# EasyEDA schematic SCH_esp32_2022-05-23.json
TITLE: Sheet_1; REV: 1.0; Date: 2022-04-08; Sheet: 1/1; Drawn By: lian_aarts; Company: Your Company
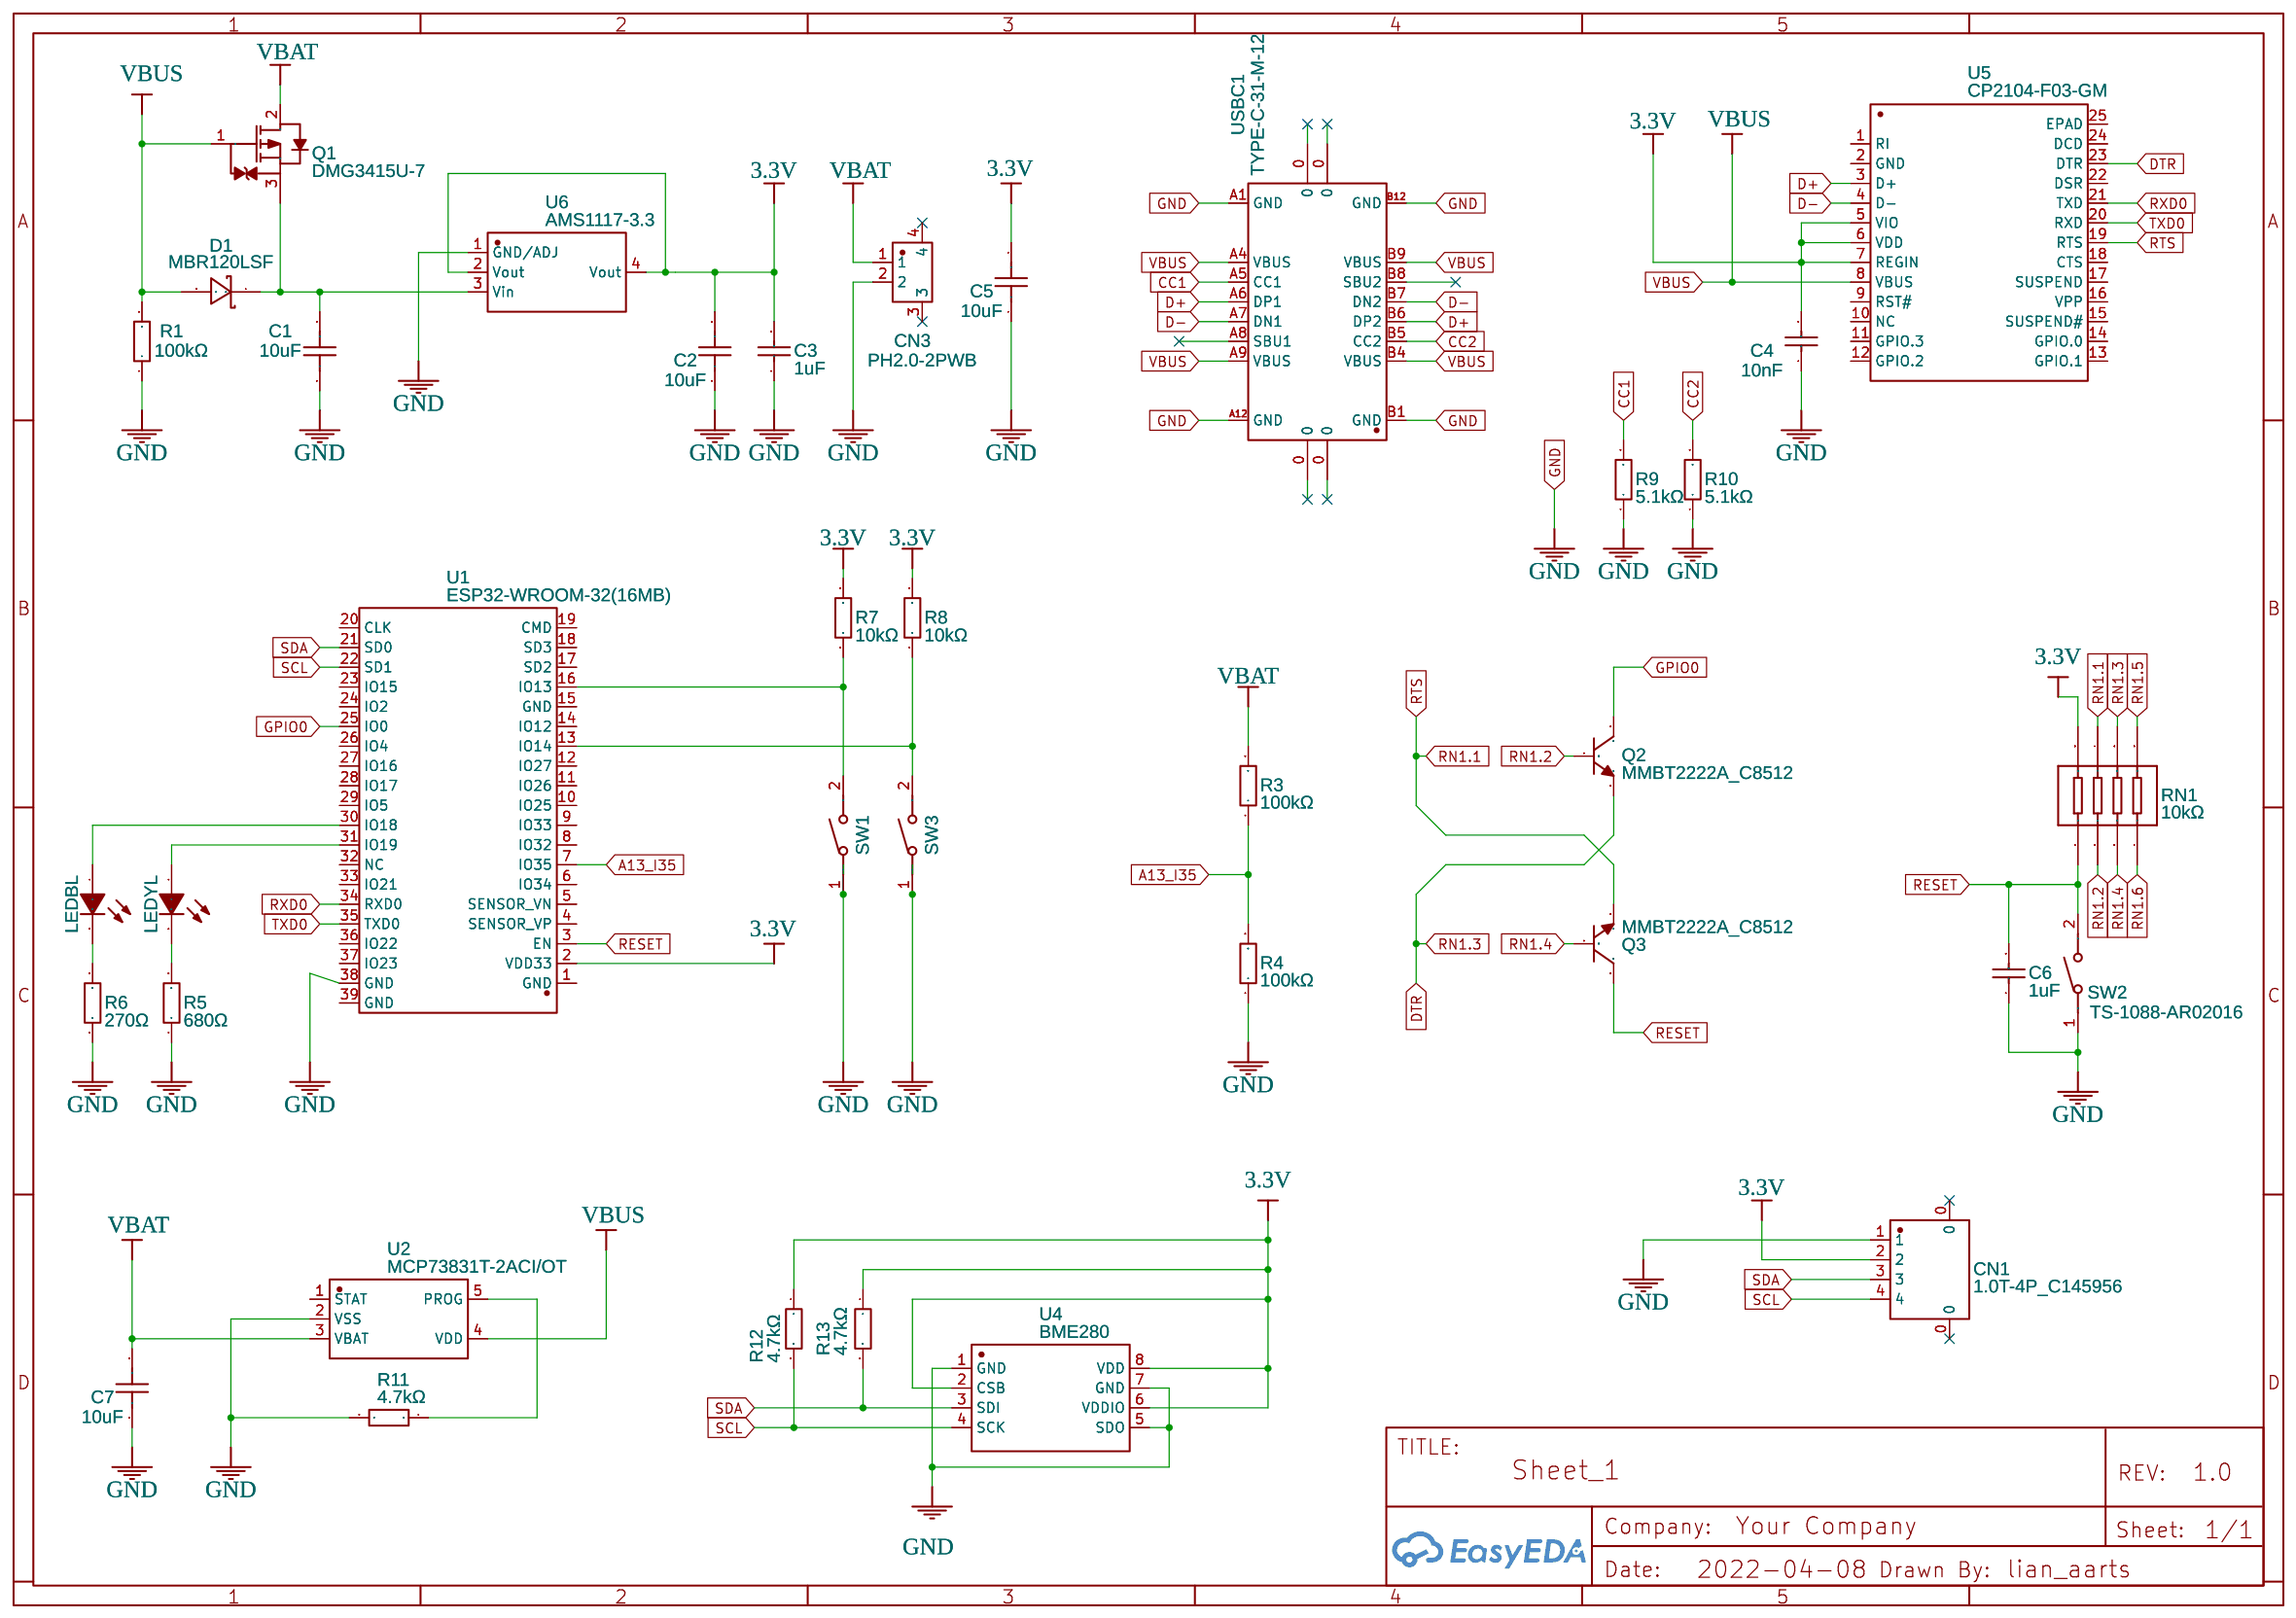
[diagram p0: schematic sheet]

## Parts
C1  10uF  [C0805]
C2  10uF  [C0805]
C3  1uF  [C0603]
C4  10nF  [C0805]
C5  10uF  [C0805]
C6  1uF  [C0603]
C7  10uF  [C0805]
CN1  1.0T-4P_C145956  [CONN-SMD_1.0T-4P]
CN3  PH2.0-2PWB  [CONN-SMD_2P-P2.00_PH2.0-SPWB]
D1  MBR120LSF  [SOD-123_L2.8-W1.8-LS3.7-RD]
LEDBL  19-217/BHC-ZL1M2RY/3T  [LED0603-R-RD_BLUE]
LEDYL  19-213/Y2C-CQ2R2L/3T(CY)  [LED0603-R-RD]
Q1  DMG3415U-7  [SOT-23-3_L2.9-W1.6-P1.90-LS2.8-BR-CW]
Q2  MMBT2222A_C8512  [SOT-23-3_L2.9-W1.3-P1.90-LS2.4-BR]
Q3  MMBT2222A_C8512  [SOT-23-3_L2.9-W1.3-P1.90-LS2.4-BR]
R1  100kΩ  [R0603]
R3  100kΩ  [R0603]
R4  100kΩ  [R0603]
R5  680Ω  [R0603]
R6  270Ω  [R0603]
R7  10kΩ  [R0603]
R8  10kΩ  [R0603]
R9  5.1kΩ  [R0603]
R10  5.1kΩ  [R0603]
R11  4.7kΩ  [R0603]
R12  4.7kΩ  [R0603]
R13  4.7kΩ  [R0603]
RN1  10kΩ  [RES-ARRAY-SMD_0603-8P-L3.2-W1.6-BL]
SW1  TS-1088-AR02016  [SW-SMD_L4.0-W2.9-LS5.0]
SW2  TS-1088-AR02016  [SW-SMD_L4.0-W2.9-LS5.0]
SW3  TS-1088-AR02016  [SW-SMD_L4.0-W2.9-LS5.0]
U1  ESP32-WROOM-32(16MB)  [WIFIM-SMD_39P-L25.5-W18.0-P1.27]
U2  MCP73831T-2ACI/OT  [SOT-23-5_L3.0-W1.7-P0.95-LS2.8-BR]
U4  BME280  [LGA-8_BME280_BL]
U5  CP2104-F03-GM  [QFN-24_L4.0-W4.0-P0.50-BL-EP2.7]
U6  AMS1117-3.3  [SOT-223-3_L6.5-W3.4-P2.30-LS7.0-BR]
USBC1  TYPE-C-31-M-12  [USB-C_SMD-TYPE-C-31-M-12]

## Library data of the parts
C1 C2 C5 C7 = GRM21BR61H106KE43L: Supplier: LCSC; Supplier Part: C440198; Manufacturer: Murata Electronics; Contributor: LCSC; JLCPCB Part Class: Basic Part
C3 C6 = CL10A105KB8NNNC: Supplier: LCSC; Manufacturer: SAMSUNG; Supplier Part: C15849; JLCPCB Part Class: Basic Part
C4 = CL21B103KBANNNC: Supplier: LCSC; Manufacturer: SAMSUNG; Supplier Part: C1710; JLCPCB Part Class: Basic Part
CN1 = 1.0T-4P_C145956: Supplier: LCSC; Supplier Part: C145956; Manufacturer: Boom Precision Elec; Contributor: 立创EDA官方封装库; JLCPCB Part Class: Extended Part
CN3 = PH2.0-2PWB: Supplier: LCSC; Manufacturer: BOOMELE; Manufacturer Part: PH2.0-2PWB Horizontal; Supplier Part: C47647; JLCPCB Part Class: Extended Part
D1 = MBR120LSF: Supplier: LCSC; Manufacturer: SK; Contributor: LCSC; Supplier Part: C130880; JLCPCB Part Class: Extended Part
LEDBL = 19-217/BHC-ZL1M2RY/3T: Supplier: LCSC; Manufacturer: EVERLIGHT; Supplier Part: C72041; JLCPCB Part Class: Basic Part
LEDYL = 19-213/Y2C-CQ2R2L/3T(CY): Supplier: LCSC; Manufacturer: EVERLIGHT; Supplier Part: C72038; JLCPCB Part Class: Basic Part
Q1 = DMG3415U-7: Supplier: LCSC; Supplier Part: C96616; Manufacturer: Diodes Incorporated; Contributor: LCSC; JLCPCB Part Class: Extended Part
Q2 Q3 = MMBT2222A_C8512: Supplier: LCSC; Manufacturer: CJ; Manufacturer Part: MMBT2222A; Supplier Part: C8512; JLCPCB Part Class: Basic Part
R1 R3 R4 = 0603WAF1003T5E: Supplier: LCSC; Manufacturer: UniOhm; Supplier Part: C25803; Resistance (Ohms): 100K; JLCPCB Part Class: Basic Part
R5 = 0603WAF6800T5E: Supplier: LCSC; Manufacturer: UniOhm; Supplier Part: C23228; Resistance (Ohms): 680; JLCPCB Part Class: Basic Part
R6 = 0603WAF2700T5E: Supplier: LCSC; Manufacturer: UniOhm; Supplier Part: C22966; Resistance (Ohms): 270; JLCPCB Part Class: Basic Part
R7 R8 = 0603WAF1002T5E: Supplier: LCSC; Manufacturer: UniOhm; Supplier Part: C25804; Resistance (Ohms): 10K; JLCPCB Part Class: Basic Part
R9 R10 = 0603WAF5101T5E: Supplier: LCSC; Manufacturer: UniOhm; Supplier Part: C23186; Resistance (Ohms): 5.1K; JLCPCB Part Class: Basic Part
R11-R13 = 0603WAF4701T5E: Supplier: LCSC; Manufacturer: UniOhm; Supplier Part: C23162; Resistance (Ohms): 4.7K; JLCPCB Part Class: Basic Part
RN1 = RTA03-4D103JTP: Supplier: LCSC; Manufacturer: RALEC; Supplier Part: C102646; Resistance (Ohms): 10K; JLCPCB Part Class: Extended Part
SW1-SW3 = TS-1088-AR02016: Supplier: LCSC; Supplier Part: C720477; Manufacturer: XUNPU; Contributor: LCSC; JLCPCB Part Class: Extended Part
U1 = ESP32-WROOM-32(16MB): Supplier: LCSC; Supplier Part: C529581; Manufacturer: Espressif Systems; Contributor: LCSC; JLCPCB Part Class: Extended Part
U2 = MCP73831T-2ACI/OT: Supplier: LCSC; Supplier Part: C424093; Manufacturer: Microchip Tech; Contributor: LCSC; JLCPCB Part Class: Extended Part
U4 = BME280: Supplier: LCSC; Manufacturer: Bosch; Contributor: LCSC; Supplier Part: C92489; JLCPCB Part Class: Extended Part
U5 = CP2104-F03-GM: Supplier: LCSC; Manufacturer: SILICON LABS; Supplier Part: C47742; JLCPCB Part Class: Extended Part
U6 = AMS1117-3.3: sourceId: dwIGgezVh; Supplier: LCSC; Manufacturer: AMS; Supplier Part: C6186; JLCPCB Part Class: Basic Part
USBC1 = TYPE-C-31-M-12: Supplier: LCSC; Supplier Part: C165948; Manufacturer: Rectangular Connectors - Contacts; Contributor: LCSC; JLCPCB Part Class: Extended Part

## Nets
3.3V: C2.2 C3.2 C4.2 C5.2 CN1.2 R7.2 R8.2 R12.1 R13.1 RN1.8 U1.2(VDD33) U4.2(CSB) U4.6(VDDIO) U4.8(VDD) U5.5(VIO) U5.6(VDD) U5.7(REGIN) U6.2(Vout) U6.4(Vout)
GND: C1.1 C2.1 C3.1 C4.1 C5.1 C6.1 C7.1 CN1.1 CN3.2 R1.1 R4.1 R5.1 R6.1 R9.1 R10.1 R11.2 SW1.1 SW2.1 SW3.1 U1.38(GND) U2.2(VSS) U4.1(GND) U4.5(SDO) U4.7(GND) U6.1(GND/ADJ) USBC1.A1(GND) USBC1.A12(GND) USBC1.B1(GND) USBC1.B12(GND)
VBAT: C7.2 CN3.1 Q1.2(D) R3.2 U2.3(VBAT)
VBUS: D1.2(A) Q1.1(G) R1.2 U2.4(VDD) U5.8(VBUS) USBC1.A4(VBUS) USBC1.A9(VBUS) USBC1.B4(VBUS) USBC1.B9(VBUS)
A13_I35: R3.1 R4.2 U1.7(IO35)
CC1: R9.2 USBC1.A5(CC1)
CC2: R10.2 USBC1.B5(CC2)
D+: U5.3(D+) USBC1.A6(DP1) USBC1.B6(DP2)
D-: U5.4(D-) USBC1.A7(DN1) USBC1.B7(DN2)
DTR: Q2.2(E) RN1.6 U5.23(DTR)
GPIO0: Q2.3(C) U1.25(IO0)
RESET: C6.2 Q3.3(C) RN1.1 SW2.2 U1.3(EN)
RN1.1: Q3.2(E) RN1.7 U5.19(RTS)
RN1.2: Q2.1(B) RN1.2
RN1.4: Q3.1(B) RN1.3
RN1.5: RN1.5
RN1.6: RN1.4
RXD0: U1.34(RXD0) U5.21(TXD)
SCL: CN1.4 R12.2 U1.22(SD1) U4.4(SCK)
SDA: CN1.3 R13.2 U1.21(SD0) U4.3(SDI)
TXD0: U1.35(TXD0) U5.20(RXD)
Net-(C1-2): C1.2 D1.1(C) Q1.3(S) U6.3(Vin)
Net-(LEDBL-1): LEDBL.1(A) U1.30(IO18)
Net-(LEDBL-2): LEDBL.2(C) R6.2
Net-(LEDYL-1): LEDYL.1(A) U1.31(IO19)
Net-(LEDYL-2): LEDYL.2(C) R5.2
Net-(R7-1): R7.1 SW1.2 U1.16(IO13)
Net-(R8-1): R8.1 SW3.2 U1.13(IO14)
Net-(R11-1): R11.1 U2.5(PROG)

Not connected (* = marked no-connect by the designer): CN1 0*; CN3 3* 4*; U1 1(GND) 4(SENSOR_VP) 5(SENSOR_VN) 6(IO34) 8(IO32) 9(IO33) 10(IO25) 11(IO26) 12(IO27) 14(IO12) 15(GND) 17(SD2) 18(SD3) 19(CMD) 20(CLK) 23(IO15) 24(IO2) 26(IO4) 27(IO16) 28(IO17) 29(IO5) 32(NC) 33(IO21) 36(IO22) 37(IO23) 39(GND); U2 1(STAT); U5 1(RI) 2(GND) 9(RST#) 10(NC) 11(GPIO.3) 12(GPIO.2) 13(GPIO.1) 14(GPIO.0) 15(SUSPEND#) 16(VPP) 17(SUSPEND) 18(CTS) 22(DSR) 24(DCD) 25(EPAD); USBC1 0 A8(SBU1) B8(SBU2)
